# Altium project DB-X02.PrjPcb (part 3 of 4)
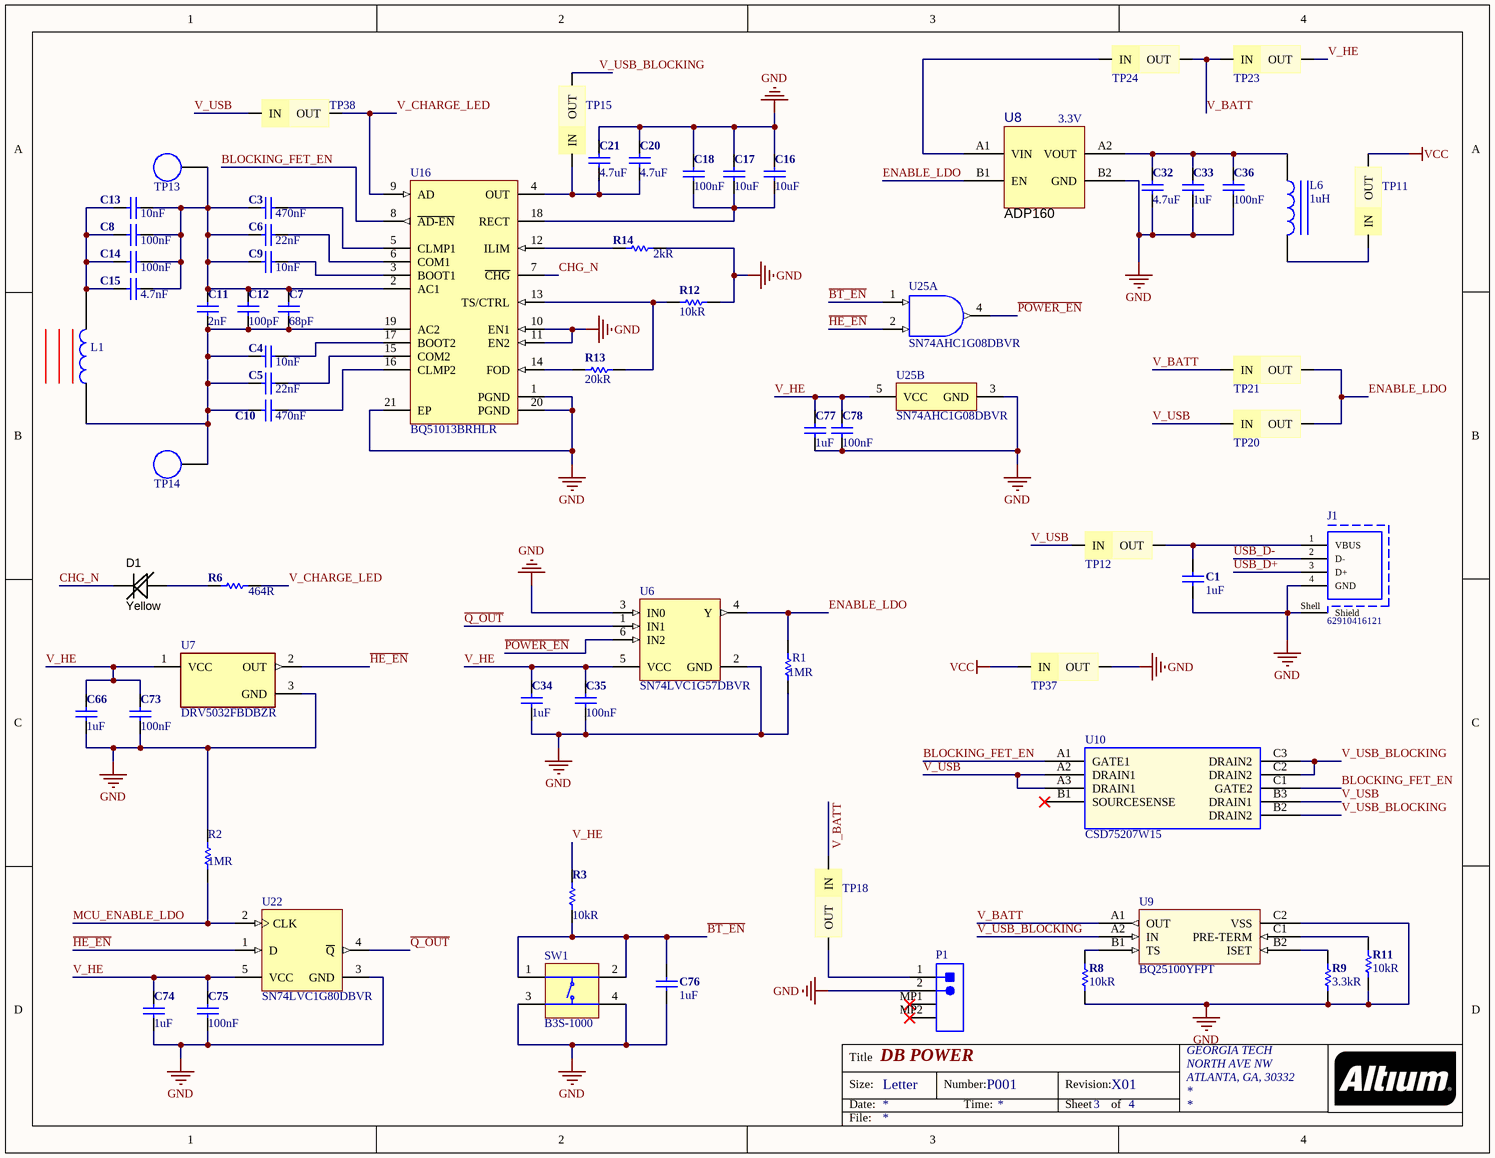
[diagram p4: DB_Power-X02.SchDoc]

## Sheet DB_Power-X02.SchDoc: DB POWER (continued)

### Library data of the parts (continued)
SW1 = CMP-1677-00001-4: Sealed Tactile Switch, SPST-NO, 3 to 24 V, -25 to 70 degC, 4-Pin SMD, RoHS, Bulk; Manufacturer: Omron; Manufacturer Part Number: B3S-1000P; Mechanical Life: 500000Cycles; Switch Function: Off-Mom; Illumination Type: Non-Illuminated; Number of Poles: 1; Switch Travel: 0.25mm; Throw Configuration: SPST; Voltage Rating (DC): 24V; Operating Force: 1.57N; Max Current Rating: 50mA; Contact Resistance: 100mR; Actuator Type: Standard; Actuator Length: 0.8mm; Ratings: IP67,Waterproof,Dust Tight; Supplier 1: Digi-Key; Supplier Part Number 1: SW836CT-ND; RoHS: Yes; Category: Tactile Switches; Stock 1: 209545; Pricing 1: 1=0.80000, 10=0.77500, 25=0.74520, 100=0.64690, 250=0.59024, 500=0.54850 (USD); Mount: Surface Mount; Weight: 0.010582oz; Contact Material: Bronze; Contact Plating: Silver; Min Operating Temperature: -25°C; Max Operating Temperature: 70°C; Orientation: Straight; Termination: Gull Wing; Electrical Life: 500000Cycles; Packaging: Tape and Reel; Package Quantity: 1; Current Rating: 50mA; Max Voltage Rating (DC): 24V; Contact Current Rating: 50mA; Length: 6.6mm; Height: 3.65mm; Depth: 9mm; Width: 6mm; Radiation Hardening: No; REACH SVHC: No SVHC; Lead Free: Lead Free; ComponentLink1URL: https://datasheet.ciiva.com:443/pdfs/VipMasterIC/IC/OMRN/OMRN-S-A0001309939/OMRN-S-A0001309939-1.pdf?src-supplier=IHS+Markit; ComponentLink1Description: https://datasheet.ciiva.com:443/pdfs/VipMasterIC/IC/OMRN/OMRN-S-A0001309939/OMRN-S-A0001309939-1.pdf?src-supplier=IHS+Markit; ComponentLink2URL: https://datasheet.ciiva.com/2899/b3s-1110-2899873.pdf?src-supplier=Digi-Key; ComponentLink2Description: https://datasheet.ciiva.com/2899/b3s-1110-2899873.pdf?src-supplier=Digi-Key; ComponentLink3URL: https://datasheet.ciiva.com/2899/b3s-1110-2899874.pdf?src-supplier=Digi-Key; ComponentLink3Description: https://datasheet.ciiva.com/2899/b3s-1110-2899874.pdf?src-supplier=Digi-Key; ComponentLink4URL: https://datasheet.ciiva.com/2899/b3s-1110-2899875.pdf?src-supplier=Digi-Key; ComponentLink4Description: https://datasheet.ciiva.com/2899/b3s-1110-2899875.pdf?src-supplier=Digi-Key; ComponentLink5URL: https://datasheet.ciiva.com/15183/getdatasheetpartid-211358-15183771.pdf?src-supplier=Verical; ComponentLink5Description: https://datasheet.ciiva.com/15183/getdatasheetpartid-211358-15183771.pdf?src-supplier=Verical; ComponentLink6URL: https://datasheet.ciiva.com/27056/2086750-27056652.pdf?src-supplier=Jameco; ComponentLink6Description: https://datasheet.ciiva.com/27056/2086750-27056652.pdf?src-supplier=Jameco; ComponentLink7URL: https://datasheet.ciiva.com/16155/en-b3s-16155006.pdf?src-supplier=Onlinecomponents.com; ComponentLink7Description: https://datasheet.ciiva.com/16155/en-b3s-16155006.pdf?src-supplier=Onlinecomponents.com; ComponentLink8URL: https://datasheet.ciiva.com/30125/en-b3s-30125455.pdf?src-supplier=Onlinecomponents.com; ComponentLink8Description: https://datasheet.ciiva.com/30125/en-b3s-30125455.pdf?src-supplier=Onlinecomponents.com
TP11 TP12 TP15 TP18 TP20 TP21 TP23 TP24 TP37 TP38 = JUMPER: SHUNT LP W/HANDLE 2 POS 30AU; Manufacturer: TE Connectivity; Manufacturer Part Number: 8815452; Number of Contacts: 2; Contact Current Rating: 3A; Contact Resistance: 15mR; Gender: Female; Pitch: 2.54mm; Approvals: UL,CSA; Supplier 1: Digi-Key; Supplier Part Number 1: A26242-ND; RoHS: Yes; Category: Headers and Wire Housings; Stock 1: 2099; Pricing 1: 1=0.280000, 10=0.262000, 25=0.223600, 50=0.195600, 100=0.181700, 250=0.160760, 500=0.153760, 1000=0.125800, 2500=0.115320 (USD); Contact Plating: Gold; Housing Color: Black; Housing Material: Thermoplastic; Contact Material: Bronze; Color: Black; Min Operating Temperature: -65°C; Max Operating Temperature: 105°C; Number of Rows: 1; Package Quantity: 14000; Packaging: Bag; Orientation: Straight; Number of Positions: 2; Contact Gender: Female; Current Rating: 3A; Termination: Solder; Length: 5.08mm; Height: 10.9mm; Depth: 10.9mm; Width: 2.5mm; Radiation Hardening: No; Flammability Rating: UL94 V-0; REACH SVHC: No SVHC; ComponentLink1URL: https://datasheet.ciiva.com/1455/92946-1455888.pdf?src-supplier=Newark; ComponentLink1Description: https://datasheet.ciiva.com/1455/92946-1455888.pdf?src-supplier=Newark; ComponentLink2URL: https://datasheet.ciiva.com/19459/841467-19459897.pdf?src-supplier=Jameco; ComponentLink2Description: https://datasheet.ciiva.com/19459/841467-19459897.pdf?src-supplier=Jameco; ComponentLink3URL: https://datasheet.ciiva.com/15174/getdatasheetpartid-155768-15174939.pdf?src-supplier=Verical; ComponentLink3Description: https://datasheet.ciiva.com/15174/getdatasheetpartid-155768-15174939.pdf?src-supplier=Verical; ComponentLink4URL: https://datasheet.ciiva.com/11754/0900766b80da19e8-11754990.pdf?src-supplier=RSComponents; ComponentLink4Description: https://datasheet.ciiva.com/11754/0900766b80da19e8-11754990.pdf?src-supplier=RSComponents; ComponentLink5URL: https://datasheet.ciiva.com/30154/eng-cs-1307819-section-6-7and8-0808-30154293.pdf?src-supplier=Onlinecomponents.com; ComponentLink5Description: https://datasheet.ciiva.com/30154/eng-cs-1307819-section-6-7and8-0808-30154293.pdf?src-supplier=Onlinecomponents.com; ComponentLink6URL: https://datasheet.ciiva.com/767/eng-cd-881545-k3-767850.pdf?src-supplier=Digi-Key; ComponentLink6Description: https://datasheet.ciiva.com/767/eng-cd-881545-k3-767850.pdf?src-supplier=Digi-Key; ComponentLink7URL: https://datasheet.ciiva.com/3120/eng-cs-1307819-section-6-7and8-0808-3120202.pdf?src-supplier=Avnet; ComponentLink7Description: https://datasheet.ciiva.com/3120/eng-cs-1307819-section-6-7and8-0808-3120202.pdf?src-supplier=Avnet
TP13 TP14 = S1751-46R: PC TEST POINT TIN SMD; Manufacturer: Harwin Inc.; Supplier 1: Digi-Key; RoHS: RoHS Compliant; Stock 1: 275112; Pricing 1: 1=0.29, 10=0.272, 25=0.2324, 50=0.2032, 100=0.1888, 250=0.167, 500=0.15972, 1000=0.13068 (USD); Packaging: Cut Tape (CT); Type: PC Test Point; Terminal: 0.128" x 0.065" x 0.079" (3.25mm x 1.65mm x 2.00mm) Brass, Tin Plated; Mounting Type: Surface Mount; Material: Copper Alloy; Color: Natural; ComponentLink1URL: http://cdn.harwin.com/pdfs/S1751.pdf; ComponentLink1Description: http://cdn.harwin.com/pdfs/S1751.pdf; Supplier Part Number 1: 952-1478-1-ND; Manufacturer Part Number: S1751-46R; Category: Test and Measurement
U6 = CMP-0859-00228-3: CONFIGURABLE MULTIPLE-FUNCTION GATE, DBV0006A, LARGE T&R; Manufacturer: Texas Instruments; Number of Inputs: 3; Min Supply Voltage: 1.65V; Max Supply Voltage: 5.5V; Propagation Delay: 6.3ns; Logic Function: NAND GATE,AND GATE,NOR GATE,OR GATE,Inverter,Multi Function; Number of Circuits: 1; High Level Output Current: -32mA; Low Level Output Current: 32mA; Number of Input Lines: 2; Quiescent Current: 10uA; Schmitt Trigger Input: Yes; Turn-On Delay Time: 6.1ns; Supplier 1: Digi-Key; Supplier Part Number 1: 296-15574-1-ND; Manufacturer Part Number: SN74LVC1G57DBVR; RoHS: Yes; Category: Logic Gates; Stock 1: 11185; Pricing 1: 1=0.37000, 10=0.28100, 25=0.25320, 100=0.17480, 250=0.14720, 500=0.11960, 1000=0.09200 (USD); Mount: Surface Mount; Case/Package: SOT-23; Number of Pins: 6; Weight: 0.000229oz; Contact Plating: Gold; Min Operating Temperature: -40°C; Max Operating Temperature: 125°C; Package Quantity: 3000; Packaging: Tape and Reel; Number of Gates: 1; Number of Output Lines: 1; Number of Elements: 1; Number of Bits: 1; Output Current: 32mA; Number of Outputs: 1; Max Output Current: 32mA; Termination: SMD/SMT; Length: 3.05mm; Height: 1.3mm; Width: 1.75mm; Radiation Hardening: No; Lead Free: Lead Free; REACH SVHC: No SVHC; ComponentLink1URL: https://www.ti.com:443/lit/ds/symlink/sn74lvc1g57.pdf?src-supplier=IHS+Markit; ComponentLink1Description: https://www.ti.com:443/lit/ds/symlink/sn74lvc1g57.pdf?src-supplier=IHS+Markit; ComponentLink2URL: https://datasheet.ciiva.com/15090/getdatasheetpartid-173082-15090973.pdf?src-supplier=Verical; ComponentLink2Description: https://datasheet.ciiva.com/15090/getdatasheetpartid-173082-15090973.pdf?src-supplier=Verical; ComponentLink3URL: https://datasheet.ciiva.com/1880/sn74lvc1g57-1880083.pdf?src-supplier=Digi-Key; ComponentLink3Description: https://datasheet.ciiva.com/1880/sn74lvc1g57-1880083.pdf?src-supplier=Digi-Key; ComponentLink4URL: https://datasheet.ciiva.com/1880/sn74lvc1g57-1880084.pdf?src-supplier=Digi-Key; ComponentLink4Description: https://datasheet.ciiva.com/1880/sn74lvc1g57-1880084.pdf?src-supplier=Digi-Key; ComponentLink5URL: https://datasheet.ciiva.com/46395/1882763-46395382.pdf?src-supplier=Element14; ComponentLink5Description: https://datasheet.ciiva.com/46395/1882763-46395382.pdf?src-supplier=Element14; ComponentLink6URL: https://datasheet.ciiva.com/46439/1834192-46439175.pdf?src-supplier=Element14; ComponentLink6Description: https://datasheet.ciiva.com/46439/1834192-46439175.pdf?src-supplier=Element14; ComponentLink7URL: https://datasheet.ciiva.com/7783/1771418-7783483.pdf?src-supplier=Element14; ComponentLink7Description: https://datasheet.ciiva.com/7783/1771418-7783483.pdf?src-supplier=Element14; ComponentLink8URL: https://datasheet.ciiva.com/7783/1771418-7783484.pdf?src-supplier=Element14; ComponentLink8Description: https://datasheet.ciiva.com/7783/1771418-7783484.pdf?src-supplier=Element14; ComponentLink9URL: https://datasheet.ciiva.com/1880/sn74lvc1g57-1880082.pdf?src-supplier=Digi-Key; ComponentLink9Description: https://datasheet.ciiva.com/1880/sn74lvc1g57-1880082.pdf?src-supplier=Digi-Key; ComponentLink10URL: https://datasheet.ciiva.com/48702/001075107-da-01-en-ic-mult-fun-sn74lvc1g57dbvr-sot-23-6-tid-48702374.pdf?src-supplier=Conrad; ComponentLink10Description: https://datasheet.ciiva.com/48702/001075107-da-01-en-ic-mult-fun-sn74lvc1g57dbvr-sot-23-6-tid-48702374.pdf?src-supplier=Conrad
U7 = CMP-04937-000003-1: LP HALL 32FBDBZR; Manufacturer: Texas Instruments; Sensing Method: Hall Effect; Max Supply Current: 2.6mA; Max Output Current: 5mA; ComponentLink2Description: Datasheet; ComponentLink2URL: http://www.ti.com/lit/ds/symlink/drv5032.pdf; Supplier 1: Digi-Key; Supplier Part Number 1: 296-47323-1-ND; Manufacturer Part Number: DRV5032FBDBZR; RoHS: No; Category: Integrated Circuits (ICs); Stock 1: 6326; Pricing 1: 1=0.80000, 5=0.76600, 10=0.66600, 25=0.58520, 50=0.48600, 100=0.41400, 500=0.36000, 1000=0.31500 (USD); Case/Package: TO-236-3; Min Operating Temperature: -40°C; Max Operating Temperature: 85°C; Packaging: Cut Tape; ComponentLink1URL: https://www.ti.com:443/lit/ds/symlink/drv5032.pdf?src-supplier=IHS+Markit; ComponentLink1Description: https://www.ti.com:443/lit/ds/symlink/drv5032.pdf?src-supplier=IHS+Markit; ComponentLink3URL: http://www.ti.com/lit/ds/symlink/drv5032.pdf?src-supplier=Digi-Key; ComponentLink3Description: http://www.ti.com/lit/ds/symlink/drv5032.pdf?src-supplier=Digi-Key; ComponentLink4URL: http://www.ti.com/general/docs/suppproductinfo.tsp?distId=10&amp;gotoUrl=http%3A%2F%2Fwww.ti.com%2Flit%2Fgpn%2Fdrv5032&src-supplier=Digi-Key; ComponentLink4Description: http://www.ti.com/general/docs/suppproductinfo.tsp?distId=10&amp;gotoUrl=http%3A%2F%2Fwww.ti.com%2Flit%2Fgpn%2Fdrv5032&src-supplier=Digi-Key
U8 = ADP160-3_3V: Fixed Positive LDO Regulator, 3.3V, 0.195V Dropout, CMOS, PBGA4; Manufacturer: Analog Devices; Manufacturer Part Number: ADP160ACBZ-3.3-R7; Min Input Voltage: 2.2V; Max Input Voltage: 5.5V; Max Output Current: 150mA; Nominal Supply Current: 42uA; Number of Outputs: 1; Min Output Voltage: 1.2V; Max Output Voltage: 4.2V; Power Supply Rejection Ratio (PSRR): 60dB; Accuracy: 2%; Dropout Voltage: 105mV; Min Current Limit: 220mA; Supplier 1: Digi-Key; Supplier Part Number 1: ADP160ACBZ-3.3-R7CT-ND; RoHS: Yes; Category: Voltage Regulators - Linear; Pricing 1: 1=1.12000, 10=1.00300, 25=0.95200, 100=0.73100, 250=0.64600, 500=0.61200, 1000=0.49300 (USD); Mount: Surface Mount; Number of Pins: 4; Min Operating Temperature: -40°C; Max Operating Temperature: 125°C; Packaging: Tape and Reel; Operating Supply Current: 42uA; Package Quantity: 3000; Output Current: 150mA; Output Type: Fixed; Max Supply Current: 42uA; Polarity: Positive; Number of Regulators: 1; Nominal Output Voltage: 3.3V; Output Voltage Accuracy: 2%; Radiation Hardening: No; REACH SVHC: No SVHC; Lead Free: Contains Lead; ComponentLink1URL: https://datasheet.ciiva.com:443/pdfs/VipMasterIC/IC/ANDI/ANDI-S-A0005865400/ANDI-S-A0005865400-1.pdf?src-supplier=IHS+Markit; ComponentLink1Description: https://datasheet.ciiva.com:443/pdfs/VipMasterIC/IC/ANDI/ANDI-S-A0005865400/ANDI-S-A0005865400-1.pdf?src-supplier=IHS+Markit; ComponentLink2URL: https://datasheet.ciiva.com/15271/adp160-161-162-163-15271721.pdf?src-supplier=Arrow+Europe; ComponentLink2Description: https://datasheet.ciiva.com/15271/adp160-161-162-163-15271721.pdf?src-supplier=Arrow+Europe; ComponentLink3URL: https://datasheet.ciiva.com/8242/adp160-161-162-163-8242024.pdf?src-supplier=Avnet; ComponentLink3Description: https://datasheet.ciiva.com/8242/adp160-161-162-163-8242024.pdf?src-supplier=Avnet; ComponentLink4URL: https://datasheet.ciiva.com/18552/adp160-161-162-163-18552347.pdf?src-supplier=Digi-Key; ComponentLink4Description: https://datasheet.ciiva.com/18552/adp160-161-162-163-18552347.pdf?src-supplier=Digi-Key; ComponentLink5URL: https://datasheet.ciiva.com/18552/adp160-161-162-163-18552348.pdf?src-supplier=Digi-Key; ComponentLink5Description: https://datasheet.ciiva.com/18552/adp160-161-162-163-18552348.pdf?src-supplier=Digi-Key; ComponentLink6URL: https://datasheet.ciiva.com/18552/adp160-161-162-163-18552349.pdf?src-supplier=Digi-Key; ComponentLink6Description: https://datasheet.ciiva.com/18552/adp160-161-162-163-18552349.pdf?src-supplier=Digi-Key
U9 = BQ25100YFPT: Power Supply Support Circuit; Manufacturer: Texas Instruments; Output Voltage: 4.35V; Operating Supply Current: 75nA; Fault Protection: Over Voltage,Over Temperature,Short Circuit; Max Charge Current: 250mA; Battery Pack Voltage: 4.2V; Number of Cells: 1; Max Supply Voltage: 6.45V; Min Supply Voltage: 3.5V; Supplier 1: Digi-Key; Supplier Part Number 1: 296-38373-1-ND; Manufacturer Part Number: BQ25100YFPT; RoHS: Yes; Category: Batteries and Accessories; Stock 1: 3049; Pricing 1: 1=2.24000, 10=2.01100, 25=1.89760, 100=1.51800 (USD); Mount: Surface Mount; Number of Pins: 6; Weight: 6E-05oz; Contact Plating: Copper,Tin,Silver; Min Operating Temperature: -40°C; Max Operating Temperature: 85°C; Package Quantity: 250; Packaging: Tape and Reel; Output Current: 250mA; Lead Free: Lead Free; REACH SVHC: No SVHC; ComponentLink1URL: https://www.ti.com:443/lit/ds/symlink/bq25100.pdf?src-supplier=IHS+Markit; ComponentLink1Description: https://www.ti.com:443/lit/ds/symlink/bq25100.pdf?src-supplier=IHS+Markit; ComponentLink2URL: https://datasheet.ciiva.com/46404/1854517-46404758.pdf?src-supplier=Element14; ComponentLink2Description: https://datasheet.ciiva.com/46404/1854517-46404758.pdf?src-supplier=Element14
U10 = CSD75207W15: Small Signal Field-Effect Transistor, P-Channel, Metal-oxide Semiconductor FET; Manufacturer: Texas Instruments; Gate to Source Voltage (Vgs): -6V; Rise Time: 8.6ns; Rds On Max: 162mR; Input Capacitance: 595pF; Drain to Source Resistance: 27mR; Continuous Drain Current (ID): 3.9A; Max Power Dissipation: 700mW; Turn-On Delay Time: 12.8ns; Turn-Off Delay Time: 32.1ns; Fall Time: 16ns; Supplier 1: Digi-Key; Supplier Part Number 1: 296-40008-1-ND; Manufacturer Part Number: CSD75207W15; RoHS: Yes; Category: MOSFETs; Stock 1: 8699; Pricing 1: 1=0.62000, 10=0.54500, 25=0.51160, 100=0.37130, 250=0.35804, 500=0.31020, 1000=0.26400 (USD); Mount: Surface Mount; Number of Pins: 9; Contact Plating: Copper,Tin,Silver; Min Operating Temperature: -55°C; Max Operating Temperature: 150°C; Packaging: Tape and Reel; Package Quantity: 3000; Lead Free: Lead Free; ComponentLink1URL: https://www.ti.com:443/lit/ds/symlink/csd75207w15.pdf?src-supplier=IHS+Markit; ComponentLink1Description: https://www.ti.com:443/lit/ds/symlink/csd75207w15.pdf?src-supplier=IHS+Markit; ComponentLink2URL: https://datasheet.ciiva.com/24012/slps418-267251-24012416.pdf?src-supplier=Mouser; ComponentLink2Description: https://datasheet.ciiva.com/24012/slps418-267251-24012416.pdf?src-supplier=Mouser; ComponentLink3URL: https://datasheet.ciiva.com/30021/csd75207w15-30021933.pdf?src-supplier=Avnet; ComponentLink3Description: https://datasheet.ciiva.com/30021/csd75207w15-30021933.pdf?src-supplier=Avnet
U16 = TI-BQ51013B-RHL20: WPC 1.1 Compatible Fully Integrated Wireless Power Receiver IC, 4 V Min Input, 20-pin VQFN (RHL), Green (RoHS & no Sb/Br); Manufacturer: Texas Instruments; Operating Supply Current: 8mA; Output Current: 1.5A; Output Voltage: 5V; Supplier 1: Digi-Key; Supplier Part Number 1: 296-38885-1-ND; Manufacturer Part Number: BQ51013BRHLR; RoHS: Yes; Category: Power Management ICs; Stock 1: 8882; Pricing 1: 1=3.33000, 10=2.97000, 25=2.67320, 100=2.43540, 250=2.19780, 500=1.97208, 1000=1.66320 (USD); Mount: Surface Mount; Case/Package: VQFN; Number of Pins: 20; Contact Plating: Gold; Min Operating Temperature: 0°C; Max Operating Temperature: 125°C; Packaging: Tape and Reel; Package Quantity: 3000; Logic Function: Receiver; Lead Free: Lead Free; ComponentLink1URL: https://www.ti.com:443/lit/ds/symlink/bq51013b.pdf?src-supplier=IHS+Markit; ComponentLink1Description: https://www.ti.com:443/lit/ds/symlink/bq51013b.pdf?src-supplier=IHS+Markit; ComponentLink2URL: https://datasheet.ciiva.com/6601/bq51013b-6601292.pdf?src-supplier=Digi-Key; ComponentLink2Description: https://datasheet.ciiva.com/6601/bq51013b-6601292.pdf?src-supplier=Digi-Key
U22 = CMP-0859-00176-3: Single Positive-Edge-Triggered D-Type Flip-Flop, DBV0005A, LARGE T&R; Manufacturer: Texas Instruments; Min Supply Voltage: 1.65V; Number of Elements: 1; Max Supply Voltage: 5.5V; Clock Edge Trigger Type: Positive Edge; Propagation Delay: 9.9ns; Frequency: 160MHz; Logic Function: D-Type,Flip-Flop; Turn-On Delay Time: 1.1ns; High Level Output Current: -32mA; Low Level Output Current: 32mA; Polarity: Inverting; Supplier 1: Digi-Key; Supplier Part Number 1: 296-9851-1-ND; Manufacturer Part Number: SN74LVC1G80DBVR; RoHS: Yes; Category: Latches and Flip Flops; Stock 1: 12348; Pricing 1: 1=0.32000, 10=0.24000, 25=0.21000, 100=0.13590, 250=0.11252, 500=0.09000, 1000=0.06900 (USD); Mount: Surface Mount; Case/Package: SOT-23; Number of Pins: 5; Weight: 0.000557oz; Min Operating Temperature: -40°C; Max Operating Temperature: 125°C; Packaging: Tape and Reel; Package Quantity: 3000; Number of Bits per Element: 1; Number of Input Lines: 1; Number of Output Lines: 1; Number of Circuits: 1; Number of Bits: 1; Number of Gates: 1; Output Current: 32mA; Max Frequency: 160MHz; Radiation Hardening: No; Lead Free: Lead Free; REACH SVHC: No SVHC; ComponentLink1URL: https://www.ti.com:443/lit/ds/symlink/sn74lvc1g80.pdf?src-supplier=IHS+Markit; ComponentLink1Description: https://www.ti.com:443/lit/ds/symlink/sn74lvc1g80.pdf?src-supplier=IHS+Markit; ComponentLink2URL: https://datasheet.ciiva.com/15091/getdatasheetpartid-71921-15091286.pdf?src-supplier=Verical; ComponentLink2Description: https://datasheet.ciiva.com/15091/getdatasheetpartid-71921-15091286.pdf?src-supplier=Verical; ComponentLink3URL: https://datasheet.ciiva.com/1854/sn74lvc1g80-1854761.pdf?src-supplier=Digi-Key; ComponentLink3Description: https://datasheet.ciiva.com/1854/sn74lvc1g80-1854761.pdf?src-supplier=Digi-Key; ComponentLink4URL: https://datasheet.ciiva.com/46395/1882705-46395835.pdf?src-supplier=Element14; ComponentLink4Description: https://datasheet.ciiva.com/46395/1882705-46395835.pdf?src-supplier=Element14; ComponentLink5URL: https://datasheet.ciiva.com/1854/sn74lvc1g80-1854762.pdf?src-supplier=Digi-Key; ComponentLink5Description: https://datasheet.ciiva.com/1854/sn74lvc1g80-1854762.pdf?src-supplier=Digi-Key; ComponentLink6URL: https://datasheet.ciiva.com/8055/1831218-8055610.pdf?src-supplier=Element14; ComponentLink6Description: https://datasheet.ciiva.com/8055/1831218-8055610.pdf?src-supplier=Element14; ComponentLink7URL: https://datasheet.ciiva.com/1854/sn74lvc1g80-1854763.pdf?src-supplier=Digi-Key; ComponentLink7Description: https://datasheet.ciiva.com/1854/sn74lvc1g80-1854763.pdf?src-supplier=Digi-Key
U25 = CMP-0859-00043-3: Single 2-Input Positive-AND Gate, DBV0005A, LARGE T&R; Manufacturer: Texas Instruments; Description: AND Gate, AHC/VHC/H/U/V Series, 1-Func, 2-Input, CMOS, PDSO5; Min Supply Voltage: 2V; Max Supply Voltage: 5.5V; Propagation Delay: 7.9ns; Number of Elements: 1; Low Level Output Current: 8mA; Quiescent Current: 1uA; High Level Output Current: -8mA; Number of Inputs: 2; Turn-On Delay Time: 9ns; Schmitt Trigger Input: No; Supplier 1: Digi-Key; Supplier Part Number 1: 296-1091-1-ND; Manufacturer Part Number: SN74AHC1G08DBVR; RoHS: Yes; Category: Logic Gates; Stock 1: 70482; Pricing 1: 1=0.29000, 10=0.23700, 25=0.19800, 100=0.12540, 250=0.09680, 500=0.08250, 1000=0.05610 (USD); Mount: Surface Mount; Case/Package: SOT-23; Number of Pins: 5; Weight: 0.000557oz; Contact Plating: Tin,Matte; Min Operating Temperature: -55°C; Max Operating Temperature: 125°C; Logic Function: AND GATE; Packaging: Tape and Reel; Package Quantity: 1; Number of Circuits: 1; Number of Gates: 1; Number of Bits: 1; Number of Input Lines: 2; Number of Output Lines: 1; Number of Outputs: 1; Output Current: 8mA; Max Output Current: 8mA; Termination: SMD/SMT; Length: 2.9mm; Height: 1.15mm; Width: 1.6mm; Radiation Hardening: No; Lead Free: Lead Free; REACH SVHC: No SVHC; ComponentLink1URL: https://www.ti.com:443/lit/ds/symlink/sn74ahc1g08.pdf?src-supplier=IHS+Markit; ComponentLink1Description: https://www.ti.com:443/lit/ds/symlink/sn74ahc1g08.pdf?src-supplier=IHS+Markit; ComponentLink2URL: https://datasheet.ciiva.com/14132/sn74ahc1g08-eng-tds-14132659.pdf?src-supplier=Distrelec; ComponentLink2Description: https://datasheet.ciiva.com/14132/sn74ahc1g08-eng-tds-14132659.pdf?src-supplier=Distrelec; ComponentLink3URL: https://datasheet.ciiva.com/14290/sn74ahc1g08-14290538.pdf?src-supplier=Avnet; ComponentLink3Description: https://datasheet.ciiva.com/14290/sn74ahc1g08-14290538.pdf?src-supplier=Avnet; ComponentLink4URL: https://datasheet.ciiva.com/16503/sn74ahc1g08-16503596.pdf?src-supplier=Avnet+Asia; ComponentLink4Description: https://datasheet.ciiva.com/16503/sn74ahc1g08-16503596.pdf?src-supplier=Avnet+Asia; ComponentLink5URL: https://datasheet.ciiva.com/1864/sn74ahc1g08-1864197.pdf?src-supplier=Digi-Key; ComponentLink5Description: https://datasheet.ciiva.com/1864/sn74ahc1g08-1864197.pdf?src-supplier=Digi-Key; ComponentLink6URL: https://datasheet.ciiva.com/26048/sn74ahc1g08-26048613.pdf?src-supplier=Avnet+Europe; ComponentLink6Description: https://datasheet.ciiva.com/26048/sn74ahc1g08-26048613.pdf?src-supplier=Avnet+Europe; ComponentLink7URL: https://datasheet.ciiva.com/1864/sn74ahc1g08-1864198.pdf?src-supplier=Digi-Key; ComponentLink7Description: https://datasheet.ciiva.com/1864/sn74ahc1g08-1864198.pdf?src-supplier=Digi-Key; ComponentLink8URL: https://datasheet.ciiva.com/46384/1882822-46384390.pdf?src-supplier=Element14; ComponentLink8Description: https://datasheet.ciiva.com/46384/1882822-46384390.pdf?src-supplier=Element14; ComponentLink9URL: https://datasheet.ciiva.com/1864/sn74ahc1g08-1864199.pdf?src-supplier=Digi-Key; ComponentLink9Description: https://datasheet.ciiva.com/1864/sn74ahc1g08-1864199.pdf?src-supplier=Digi-Key; ComponentLink10URL: https://datasheet.ciiva.com/14290/sn74ahc1g08-14290535.pdf?src-supplier=Avnet; ComponentLink10Description: https://datasheet.ciiva.com/14290/sn74ahc1g08-14290535.pdf?src-supplier=Avnet